# Altium project WZ_mBoard.PrjPcb (part 2 of 2)

## Sheet STM32F103RBT6.SchDoc
size A4
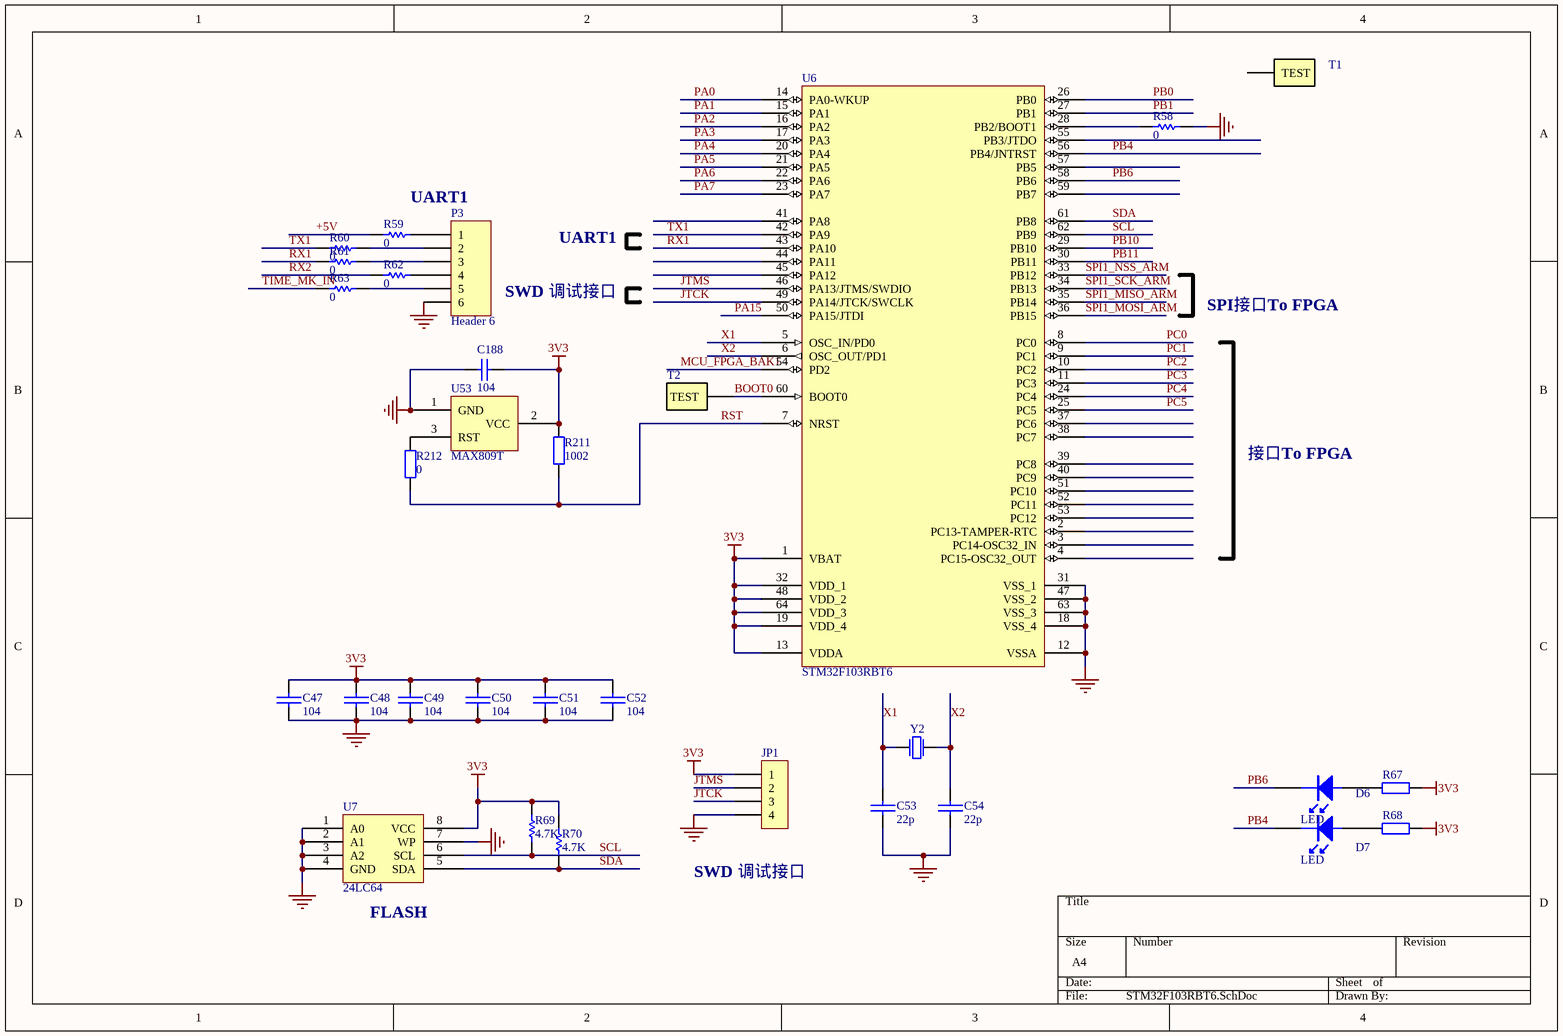
[diagram p11: STM32F103RBT6.SchDoc]

### Parts
C47  104  [0805C]
C48  104  [0805C]
C49  104  [0805C]
C50  104  [0805C]
C51  104  [0805C]
C52  104  [0805C]
C53  22p  [0805C]
C54  22p  [0805C]
C188  104  [0805C]
D6  LED  [0805_LED]
D7  LED  [0805_LED]
JP1  (no value)  [HDR1X4]
P3  Header 6  [HDR1X6]
R58  0  [0805R]
R59  0  [0805R]
R60  0  [0805R]
R61  0  [0805R]
R62  0  [0805R]
R63  0  [0805R]
R67  4701  [0805R]  (value not drawn)
R68  4701  [0805R]  (value not drawn)
R69  4.7K  [0805R]
R70  4.7K  [0805R]
R211  1002  [0805R]
R212  0  [0805R]
T1  (no value)  [TEST]
T2  (no value)  [TEST]
U6  STM32F103RBT6  [LQFP64_M]
U7  24LC64  [SO8]
U53  MAX809T  [MAX809-SOT23]
Y2  (no value)  [XTAL_8M]

### Nets
3V3: C47.1 C48.1 C49.1 C50.1 C51.1 C52.1 C188.1 JP1.1 R67.2 R68.2 R69.2 R70.2 R211.1 U6.1(VBAT) U6.13(VDDA) U6.19(VDD_4) U6.32(VDD_1) U6.48(VDD_2) U6.64(VDD_3) U7.8(VCC) U53.2(VCC)
GND: C47.2 C48.2 C49.2 C50.2 C51.2 C52.2 C53.2 C54.2 C188.2 JP1.4 P3.6 R58.2 U6.12(VSSA) U6.18(VSS_4) U6.31(VSS_1) U6.47(VSS_2) U6.63(VSS_3) U7.1(A0) U7.2(A1) U7.3(A2) U7.4(GND) U7.7(WP) U53.1(GND)  [project net DGND]
+5V: R59.1
BOOT0: T2.1(TEST) U6.60(BOOT0)
JTCK: JP1.3 U6.49(PA14/JTCK/SWCLK)
JTMS: JP1.2 U6.46(PA13/JTMS/SWDIO)
MCU_FPGA_BAK1: U6.54(PD2)
PA0: U6.14(PA0-WKUP)
PA1: U6.15(PA1)
PA2: U6.16(PA2)
PA3: U6.17(PA3)
PA4: U6.20(PA4)
PA5: U6.21(PA5)
PA6: U6.22(PA6)
PA7: U6.23(PA7)
PA15: U6.50(PA15/JTDI)
PB0: U6.26(PB0)
PB1: U6.27(PB1)
PB4: D7.2(K) U6.56(PB4/JNTRST)
PB6: D6.2(K) U6.58(PB6)
PB10: U6.29(PB10)
PB11: U6.30(PB11)
PC0: U6.8(PC0)
PC1: U6.9(PC1)
PC2: U6.10(PC2)
PC3: U6.11(PC3)
PC4: U6.24(PC4)
PC5: U6.25(PC5)
RST: R211.2 R212.2 U6.7(NRST)
RX1: R61.1 U6.43(PA10)
RX2: R62.1
SCL: R69.1 U6.62(PB9) U7.6(SCL)
SDA: R70.1 U6.61(PB8) U7.5(SDA)
SPI1_MISO_ARM: U6.35(PB14)
SPI1_MOSI_ARM: U6.36(PB15)
SPI1_NSS_ARM: U6.33(PB12)
SPI1_SCK_ARM: U6.34(PB13)
TIME_MK_IN: R63.1
TX1: R60.1 U6.42(PA9)
X1: C53.1 U6.5(OSC_IN/PD0) Y2.2(P2)
X2: C54.1 U6.6(OSC_OUT/PD1) Y2.1(P1)
NetD6_1: D6.1(A) R67.1
NetD7_1: D7.1(A) R68.1
NetP3_1: P3.1 R59.2
NetP3_2: P3.2 R60.2
NetP3_3: P3.3 R61.2
NetP3_4: P3.4 R62.2
NetP3_5: P3.5 R63.2
NetR58_1: R58.1 U6.28(PB2/BOOT1)
NetR212_1: R212.1 U53.3(RST)

Not connected (* = marked no-connect by the designer): T1 1(TEST); U6 2(PC13-TAMPER-RTC) 3(PC14-OSC32_IN) 4(PC15-OSC32_OUT) 37(PC6) 38(PC7) 39(PC8) 40(PC9) 41(PA8) 44(PA11) 45(PA12) 51(PC10) 52(PC11) 53(PC12) 55(PB3/JTDO) 57(PB5) 59(PB7)

### Notes on the sheet
- UART1
- SWD 调试接口
- SPI接口To FPGA
- 接口To FPGA
- (near U7) FLASH
- (near JP1) SWD 调试接口

### Library data of the parts
C47-C54 = CAP: Capacitor
C188 = Cap: Capacitor; Published: 8-Jun-2000; LatestRevisionDate: 17-Jul-2002; LatestRevisionNote: Re-released for DXP Platform.; PackageReference: RAD-0.3; Publisher: Altium Limited; Value: 104
JP1 = CON4: Connector
P3 = Header 6: Header, 6-Pin; LatestRevisionDate: 17-Jul-2002; LatestRevisionNote: Re-released for DXP Platform.; Publisher: Altium Limited
R58-R63 R69 R70 = Res1: Resistor; Published: *; Revision: *; Publisher: *; Value: *
R67 R68 = Res2: Resistor; Value: 5K; Published: 8-Jun-2000; LatestRevisionDate: 17-Jul-2002; LatestRevisionNote: Re-released for DXP Platform.; PackageReference: AXIAL-0.4; Publisher: Altium Limited
R211 = Res2: Resistor; Value: 10K; Published: 8-Jun-2000; LatestRevisionDate: 17-Jul-2002; LatestRevisionNote: Re-released for DXP Platform.; PackageReference: AXIAL-0.4; Publisher: Altium Limited
R212 = Res2: Resistor; Value: 330R; Published: 8-Jun-2000; LatestRevisionDate: 17-Jul-2002; LatestRevisionNote: Re-released for DXP Platform.; PackageReference: AXIAL-0.4; Publisher: Altium Limited
T1 T2 = TEST
U6 = STM32F103RBT6: STM32 ARM-based 32-bit MCU with 128 Kbytes Flash, 64-pin LQFP, Industrial Temperature; Published: *; DatasheetVersion: *; PackageVersion: *; PackageReference: *; Publisher: *; PackageDescription: *; ComponentLink1Description: *; ComponentLink1URL: *; ComponentLink2Description: *; ComponentLink2URL: *
U7 = 24C02
Y2 = XTAL: Crystal Oscillator

## Nets that join several sheets
CH_+3.3V: EP4CE75 (46 pins), FPGA_PWR (29 pins), NET (29 pins)
DGND: IMx6Q (26 pins), IMx6Q_EX (99 pins), EP4CE75 (103 pins), FPGA_PWR (71 pins), NET (35 pins), 485Driver_MAX3462 (10 pins), STM32F103RBT6 (23 pins)
GEN6_3V3: IMx6Q (U1.151), IMx6Q_EX (R7.1)
GEN_3V3: IMx6Q (R2.2 U1.149 U1.150), IMx6Q_EX (9 pins)
USB_OTG_VBUS: IMx6Q (U1.82), IMx6Q_EX (Q2.1 R31.2)
+5V: IMx6Q (D1.1), FPGA_PWR (6 pins), 485Driver_MAX3462 (6 pins), STM32F103RBT6 (R59.1)
BOOT: IMx6Q (U1.6), IMx6Q_EX (SW2.1 SW2.2)
CMD_BUS: EP4CE75 (U56.Y1), 485Driver_MAX3462 (R49.1)
E1_COL: EP4CE75 (U56.B9), NET (R225.2 U52.31)
E1_CRS: EP4CE75 (U56.A9), NET (R209.2 U52.32)
E1_GTXC: EP4CE75 (U56.A13), NET (U52.34)
E1_MDC: EP4CE75 (U56.C19), NET (R88.1 U52.53)
E1_MDIO: EP4CE75 (U56.A20), NET (R90.1 U52.54)
E1_RESET: EP4CE75 (U56.B13), NET (R227.2 U52.38)
E1_RXC: EP4CE75 (U56.A11), NET (R196.2)
E1_RXD0: EP4CE75 (U56.A4), NET (R199.2)
E1_RXD1: EP4CE75 (U56.B4), NET (R200.2)
E1_RXD2: EP4CE75 (U56.A5), NET (R201.2)
E1_RXD3: EP4CE75 (U56.A6), NET (R202.2)
E1_RXD4: EP4CE75 (U56.A10), NET (R203.2 R224.2)
E1_RXD5: EP4CE75 (U56.B10), NET (R204.1 R218.2)
E1_RXD6: EP4CE75 (U56.A8), NET (R205.2 R222.2)
E1_RXD7: EP4CE75 (U56.B8), NET (R206.2 R216.2)
E1_RXDV: EP4CE75 (U56.A3), NET (R197.2 R226.1)
E1_RXER: EP4CE75 (U56.A7), NET (R198.2 R217.2)
E1_TXC: EP4CE75 (U56.B14), NET (R177.2)
E1_TXD0: EP4CE75 (U56.B16), NET (U52.36)
E1_TXD1: EP4CE75 (U56.A16), NET (U52.39)
E1_TXD2: EP4CE75 (U56.B17), NET (U52.40)
E1_TXD3: EP4CE75 (U56.A17), NET (U52.41)
E1_TXD4: EP4CE75 (U56.B18), NET (U52.43)
E1_TXD5: EP4CE75 (U56.A18), NET (U52.44)
E1_TXD6: EP4CE75 (U56.B19), NET (U52.45)
E1_TXD7: EP4CE75 (U56.A19), NET (U52.46)
E1_TXEN: EP4CE75 (U56.A15), NET (U52.35)
E1_TXER: EP4CE75 (U56.B20), NET (R194.1 U52.47)
ETH_REF_CLK: IMx6Q (U1.45), IMx6Q_EX (R17.1)
ETH_WOL_INT: IMx6Q (U1.47), IMx6Q_EX (R4.2 U2.40)
MAIN_+1.2V: EP4CE75 (58 pins), FPGA_PWR (20 pins)
MAIN_+2.5V: EP4CE75 (5 pins), FPGA_PWR (6 pins)
Main_Data: EP4CE75 (U56.AB5), 485Driver_MAX3462 (R50.1)
Main_Data_1: EP4CE75 (U56.W1), 485Driver_MAX3462 (R48.1)
PA0: EP4CE75 (U56.AB17), STM32F103RBT6 (U6.14)
PA1: EP4CE75 (U56.AA16), STM32F103RBT6 (U6.15)
PA2: EP4CE75 (U56.AB16), STM32F103RBT6 (U6.16)
PA3: EP4CE75 (U56.AA15), STM32F103RBT6 (U6.17)
PA4: EP4CE75 (U56.AB15), STM32F103RBT6 (U6.20)
PA5: EP4CE75 (U56.AA14), STM32F103RBT6 (U6.21)
PA6: EP4CE75 (U56.AB14), STM32F103RBT6 (U6.22)
PA7: EP4CE75 (U56.AA13), STM32F103RBT6 (U6.23)
PB0: EP4CE75 (U56.AB10), STM32F103RBT6 (U6.26)
PB1: EP4CE75 (U56.AA9), STM32F103RBT6 (U6.27)
PC0: EP4CE75 (U56.AA21), STM32F103RBT6 (U6.8)
PC1: EP4CE75 (U56.AB20), STM32F103RBT6 (U6.9)
PC2: EP4CE75 (U56.AB18), STM32F103RBT6 (U6.10)
PC3: EP4CE75 (U56.AA17), STM32F103RBT6 (U6.11)
PC4: EP4CE75 (U56.AB13), STM32F103RBT6 (U6.24)
PC5: EP4CE75 (U56.AA10), STM32F103RBT6 (U6.25)
POWER_ON: IMx6Q (U1.7), IMx6Q_EX (SW1.1 SW1.2)
RESET: IMx6Q (U1.8), IMx6Q_EX (C26.2 SW3.1 SW3.2)
RGMII_INT: IMx6Q (U1.46), IMx6Q_EX (R8.1 U2.5)
RGMII_MDC: IMx6Q (U1.44), IMx6Q_EX (U2.1)
RGMII_MDIO: IMx6Q (U1.58), IMx6Q_EX (R5.2 U2.48)
RGMII_NRST: IMx6Q (U1.48), IMx6Q_EX (R6.1)
RGMII_RXCLK: IMx6Q (U1.54), IMx6Q_EX (RP2.6)
RGMII_RXD0: IMx6Q (U1.53), IMx6Q_EX (RP3.8)
RGMII_RXD1: IMx6Q (U1.52), IMx6Q_EX (RP3.7)
RGMII_RXD2: IMx6Q (U1.51), IMx6Q_EX (RP3.6)
RGMII_RXD3: IMx6Q (U1.50), IMx6Q_EX (RP3.5)
RGMII_RXDV: IMx6Q (U1.49), IMx6Q_EX (RP2.5)
RGMII_TXCLK: IMx6Q (U1.62), IMx6Q_EX (RP2.8)
RGMII_TXD0: IMx6Q (U1.61), IMx6Q_EX (RP1.5)
RGMII_TXD1: IMx6Q (U1.60), IMx6Q_EX (RP1.6)
RGMII_TXD2: IMx6Q (U1.59), IMx6Q_EX (RP1.7)
RGMII_TXD3: IMx6Q (U1.57), IMx6Q_EX (RP1.8)
RGMII_TXEN: IMx6Q (U1.56), IMx6Q_EX (RP2.7)
SATA_DEVSLP: IMx6Q (U1.96), IMx6Q_EX (R39.2)
SATA_EN: IMx6Q (U1.198), IMx6Q_EX (R43.1)
SATA_RX+: IMx6Q (U1.102), IMx6Q_EX (C39.1)
SATA_RX-: IMx6Q (U1.101), IMx6Q_EX (C38.1)
SATA_TX+: IMx6Q (U1.98), IMx6Q_EX (C34.1)
SATA_TX-: IMx6Q (U1.99), IMx6Q_EX (C36.1)
SD2_CD: IMx6Q (U1.64), IMx6Q_EX (CON2.11 R23.1)
SD2_CLK: IMx6Q (U1.69), IMx6Q_EX (C28.2 CON2.5)
SD2_CMD: IMx6Q (U1.71), IMx6Q_EX (CON2.2 R21.1)
SD2_DATA0: IMx6Q (U1.66), IMx6Q_EX (CON2.7)
SD2_DATA1: IMx6Q (U1.65), IMx6Q_EX (CON2.8)
SD2_DATA2: IMx6Q (U1.74), IMx6Q_EX (CON2.9)
SD2_DATA3: IMx6Q (U1.73), IMx6Q_EX (CON2.1 R36.2)
SD2_WP: IMx6Q (U1.63), IMx6Q_EX (CON2.10 R22.1)
SD3_CD: IMx6Q (U1.84), IMx6Q_EX (CON3.11 R24.1)
SD3_CLK: IMx6Q (U1.89), IMx6Q_EX (C33.2 CON3.5)
SD3_CMD: IMx6Q (U1.91), IMx6Q_EX (CON3.2 R26.1)
SD3_DATA0: IMx6Q (U1.86), IMx6Q_EX (CON3.7)
SD3_DATA1: IMx6Q (U1.85), IMx6Q_EX (CON3.8)
SD3_DATA2: IMx6Q (U1.94), IMx6Q_EX (CON3.9)
SD3_DATA3: IMx6Q (U1.93), IMx6Q_EX (CON3.1 R37.2)
SD3_WP: IMx6Q (U1.83), IMx6Q_EX (CON3.10 R25.1 R38.2)
SPI1_CLK: IMx6Q (R71.2), EP4CE75 (U56.C22)
SPI1_CS0: IMx6Q (R74.2), EP4CE75 (U56.B21)
SPI1_MISO: IMx6Q (R73.2), EP4CE75 (U56.B22)
SPI1_MISO_ARM: EP4CE75 (U56.AA8), STM32F103RBT6 (U6.35)
SPI1_MOSI: IMx6Q (R72.2), EP4CE75 (U56.C21)
SPI1_MOSI_ARM: EP4CE75 (U56.AB7), STM32F103RBT6 (U6.36)
SPI1_NSS_ARM: EP4CE75 (U56.AB9), STM32F103RBT6 (U6.33)
SPI1_SCK_ARM: EP4CE75 (U56.AB8), STM32F103RBT6 (U6.34)
SPI2_CS1: IMx6Q (R78.2), EP4CE75 (U56.E22)
SPI2_MISO: IMx6Q (R75.2), EP4CE75 (U56.D21)
SPI2_MOSI: IMx6Q (R77.2), EP4CE75 (U56.E21)
SPI2_SCLK: IMx6Q (R76.2), EP4CE75 (U56.D22)
TIME_MK_IN: EP4CE75 (U56.AB6), STM32F103RBT6 (R63.1)
TIME_MK_OUT: EP4CE75 (U56.M1), 485Driver_MAX3462 (R51.2)
UART1_RX: IMx6Q (U1.15), IMx6Q_EX (R14.2)
UART1_TX: IMx6Q (U1.14), IMx6Q_EX (Q1.1)
UART2_RX: IMx6Q (U1.13), IMx6Q_EX (P1.2)
UART2_TX: IMx6Q (U1.12), IMx6Q_EX (P1.3)
USB_OTG_D+: IMx6Q (U1.80), IMx6Q_EX (R33.2)
USB_OTG_D-: IMx6Q (U1.81), IMx6Q_EX (R32.2)
USB_OTG_ID: IMx6Q (U1.79), IMx6Q_EX (R35.2)